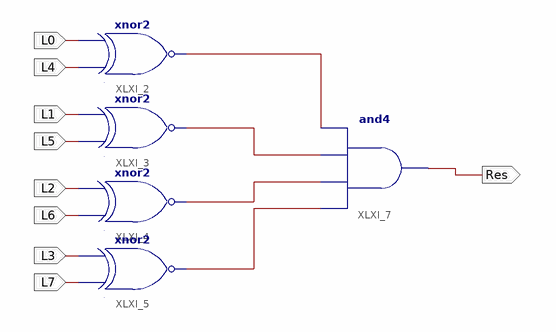
[diagram p0: schematic sheet 1]
// Xilinx ISE schematic Compare.sch (spartan6) as structural Verilog: 5 symbols, 9 ports
module Compare (
  input  L4,
  input  L0,
  input  L5,
  input  L1,
  input  L6,
  input  L2,
  input  L7,
  input  L3,
  output Res
);

  wire XLXN_1, XLXN_3, XLXN_4, XLXN_6;

  xnor XLXI_2 (XLXN_1, L4, L0);
  xnor XLXI_3 (XLXN_3, L5, L1);
  xnor XLXI_4 (XLXN_4, L6, L2);
  xnor XLXI_5 (XLXN_6, L7, L3);
  and XLXI_7 (Res, XLXN_6, XLXN_4, XLXN_3, XLXN_1);
endmodule
